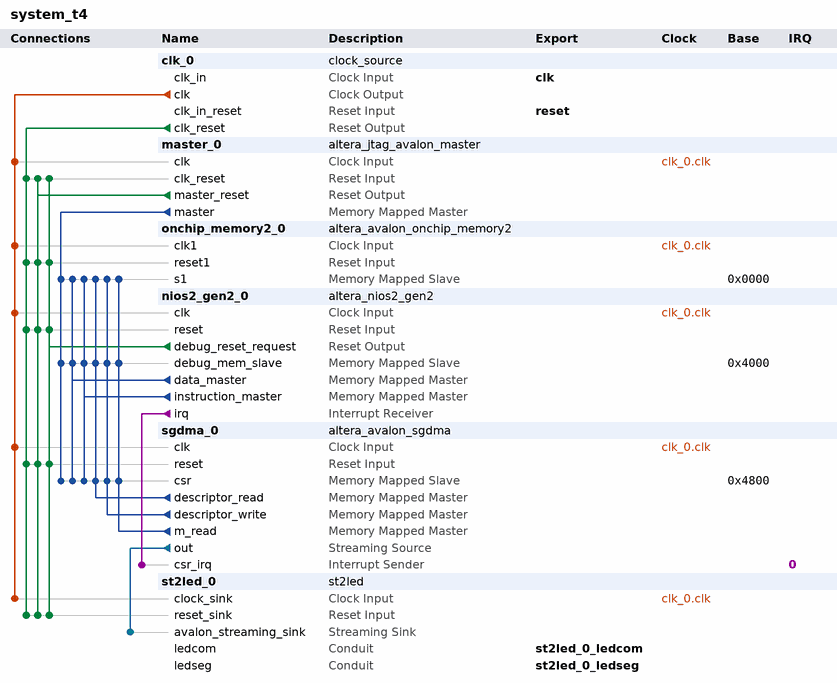
[diagram p0: system contents]
# Platform Designer (Qsys) system system_t4, Cyclone IV E EP4CE6E22C8
# Parameters at their usual value, and those the tool derives, are not listed.
package require -exact qsys 18.1
create_system system_t4
set_project_property DEVICE_FAMILY {Cyclone IV E}
set_project_property DEVICE EP4CE6E22C8

add_instance clk_0 clock_source 18.1
set_instance_parameter_value clk_0 clockFrequency 50000000

add_instance master_0 altera_jtag_avalon_master 18.1

add_instance onchip_memory2_0 altera_avalon_onchip_memory2 18.1
set_instance_parameter_value onchip_memory2_0 dataWidth 32
set_instance_parameter_value onchip_memory2_0 dualPort false
set_instance_parameter_value onchip_memory2_0 initMemContent false
set_instance_parameter_value onchip_memory2_0 initializationFileName onchip_mem.hex
set_instance_parameter_value onchip_memory2_0 memorySize 16384

add_instance nios2_gen2_0 altera_nios2_gen2 18.1
set_instance_parameter_value nios2_gen2_0 dcache_size 0
set_instance_parameter_value nios2_gen2_0 exceptionSlave onchip_memory2_0.s1
set_instance_parameter_value nios2_gen2_0 icache_size 0
set_instance_parameter_value nios2_gen2_0 impl Fast
set_instance_parameter_value nios2_gen2_0 resetSlave onchip_memory2_0.s1

add_instance sgdma_0 altera_avalon_sgdma 18.1
set_instance_parameter_value sgdma_0 enableBurstTransfers false
set_instance_parameter_value sgdma_0 enableUnalignedTransfers false
set_instance_parameter_value sgdma_0 readBlockDataWidth 8
set_instance_parameter_value sgdma_0 sinkErrorWidth 0
set_instance_parameter_value sgdma_0 sourceErrorWidth 0
set_instance_parameter_value sgdma_0 transferMode MEMORY_TO_STREAM
set_instance_parameter_value sgdma_0 writeBurstcountWidth 4

add_instance st2led_0 st2led 1.0
set_instance_parameter_value st2led_0 DIV 14

# connections
add_connection clk_0.clk master_0.clk clock
add_connection clk_0.clk nios2_gen2_0.clk clock
add_connection clk_0.clk onchip_memory2_0.clk1 clock
add_connection clk_0.clk sgdma_0.clk clock
add_connection clk_0.clk st2led_0.clock_sink clock
add_connection clk_0.clk_reset master_0.clk_reset reset
add_connection clk_0.clk_reset nios2_gen2_0.reset reset
add_connection clk_0.clk_reset onchip_memory2_0.reset1 reset
add_connection clk_0.clk_reset sgdma_0.reset reset
add_connection clk_0.clk_reset st2led_0.reset_sink reset
add_connection master_0.master_reset master_0.clk_reset reset
add_connection master_0.master_reset nios2_gen2_0.reset reset
add_connection master_0.master_reset onchip_memory2_0.reset1 reset
add_connection master_0.master_reset sgdma_0.reset reset
add_connection master_0.master_reset st2led_0.reset_sink reset
add_connection nios2_gen2_0.debug_reset_request master_0.clk_reset reset
add_connection nios2_gen2_0.debug_reset_request nios2_gen2_0.reset reset
add_connection nios2_gen2_0.debug_reset_request onchip_memory2_0.reset1 reset
add_connection nios2_gen2_0.debug_reset_request sgdma_0.reset reset
add_connection nios2_gen2_0.debug_reset_request st2led_0.reset_sink reset
add_connection master_0.master nios2_gen2_0.debug_mem_slave avalon
set_connection_parameter_value master_0.master/nios2_gen2_0.debug_mem_slave baseAddress 0x4000
add_connection master_0.master onchip_memory2_0.s1 avalon
set_connection_parameter_value master_0.master/onchip_memory2_0.s1 baseAddress 0x0000
add_connection master_0.master sgdma_0.csr avalon
set_connection_parameter_value master_0.master/sgdma_0.csr baseAddress 0x4800
add_connection nios2_gen2_0.data_master nios2_gen2_0.debug_mem_slave avalon
set_connection_parameter_value nios2_gen2_0.data_master/nios2_gen2_0.debug_mem_slave baseAddress 0x4000
add_connection nios2_gen2_0.data_master onchip_memory2_0.s1 avalon
set_connection_parameter_value nios2_gen2_0.data_master/onchip_memory2_0.s1 baseAddress 0x0000
add_connection nios2_gen2_0.data_master sgdma_0.csr avalon
set_connection_parameter_value nios2_gen2_0.data_master/sgdma_0.csr baseAddress 0x4800
add_connection nios2_gen2_0.instruction_master nios2_gen2_0.debug_mem_slave avalon
set_connection_parameter_value nios2_gen2_0.instruction_master/nios2_gen2_0.debug_mem_slave baseAddress 0x4000
add_connection nios2_gen2_0.instruction_master onchip_memory2_0.s1 avalon
set_connection_parameter_value nios2_gen2_0.instruction_master/onchip_memory2_0.s1 baseAddress 0x0000
add_connection nios2_gen2_0.instruction_master sgdma_0.csr avalon
set_connection_parameter_value nios2_gen2_0.instruction_master/sgdma_0.csr baseAddress 0x4800
add_connection sgdma_0.descriptor_read nios2_gen2_0.debug_mem_slave avalon
set_connection_parameter_value sgdma_0.descriptor_read/nios2_gen2_0.debug_mem_slave baseAddress 0x4000
add_connection sgdma_0.descriptor_read onchip_memory2_0.s1 avalon
set_connection_parameter_value sgdma_0.descriptor_read/onchip_memory2_0.s1 baseAddress 0x0000
add_connection sgdma_0.descriptor_read sgdma_0.csr avalon
set_connection_parameter_value sgdma_0.descriptor_read/sgdma_0.csr baseAddress 0x4800
add_connection sgdma_0.descriptor_write nios2_gen2_0.debug_mem_slave avalon
set_connection_parameter_value sgdma_0.descriptor_write/nios2_gen2_0.debug_mem_slave baseAddress 0x4000
add_connection sgdma_0.descriptor_write onchip_memory2_0.s1 avalon
set_connection_parameter_value sgdma_0.descriptor_write/onchip_memory2_0.s1 baseAddress 0x0000
add_connection sgdma_0.descriptor_write sgdma_0.csr avalon
set_connection_parameter_value sgdma_0.descriptor_write/sgdma_0.csr baseAddress 0x4800
add_connection sgdma_0.m_read nios2_gen2_0.debug_mem_slave avalon
set_connection_parameter_value sgdma_0.m_read/nios2_gen2_0.debug_mem_slave baseAddress 0x4000
add_connection sgdma_0.m_read onchip_memory2_0.s1 avalon
set_connection_parameter_value sgdma_0.m_read/onchip_memory2_0.s1 baseAddress 0x0000
add_connection sgdma_0.m_read sgdma_0.csr avalon
set_connection_parameter_value sgdma_0.m_read/sgdma_0.csr baseAddress 0x4800
add_connection sgdma_0.out st2led_0.avalon_streaming_sink avalon_streaming
add_connection nios2_gen2_0.irq sgdma_0.csr_irq interrupt
set_connection_parameter_value nios2_gen2_0.irq/sgdma_0.csr_irq irqNumber 0

# exported interfaces
add_interface clk clock sink
set_interface_property clk EXPORT_OF clk_0.clk_in
add_interface reset reset sink
set_interface_property reset EXPORT_OF clk_0.clk_in_reset
add_interface st2led_0_ledcom conduit end
set_interface_property st2led_0_ledcom EXPORT_OF st2led_0.ledcom
add_interface st2led_0_ledseg conduit end
set_interface_property st2led_0_ledseg EXPORT_OF st2led_0.ledseg

set_interconnect_requirement {$system} qsys_mm.clockCrossingAdapter HANDSHAKE
set_interconnect_requirement {$system} qsys_mm.enableEccProtection FALSE
set_interconnect_requirement {$system} qsys_mm.insertDefaultSlave FALSE
set_interconnect_requirement {$system} qsys_mm.maxAdditionalLatency 1

save_system system_t4.qsys
